# EAGLE design mps340g + mbi270 (EAGLE 9.5.1)
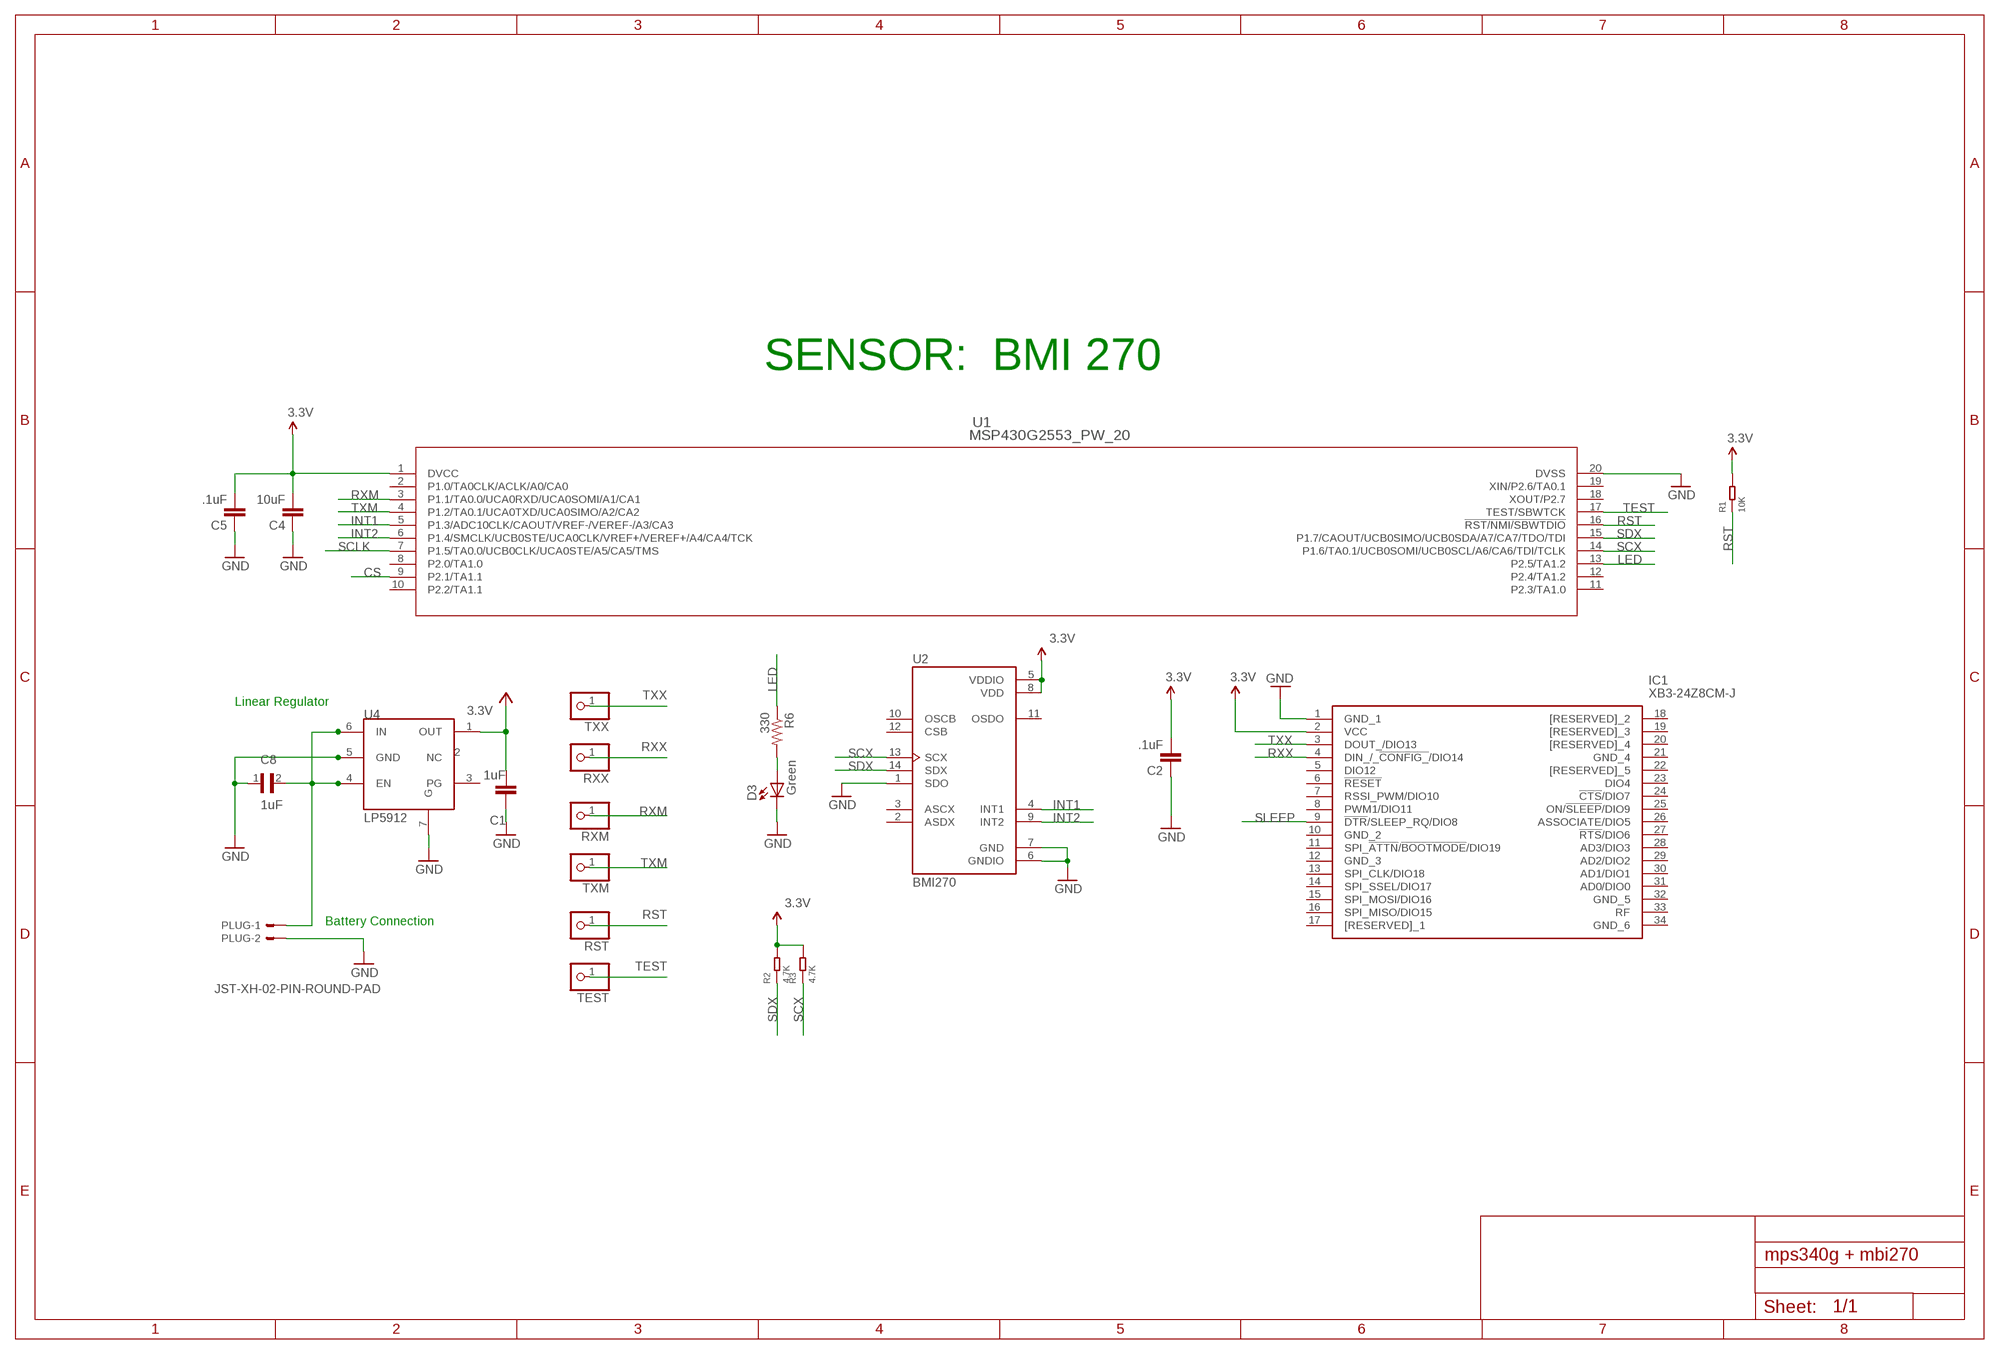
[diagram p0: schematic, sheet 1]

## Parts
C1  1uF  C-EUC0603  [C0603]
C2  .1uF  0.1UF-25V(+80/-20%)(0603)  [0603-CAP]
C4  10uF  0.1UF-25V(+80/-20%)(0603)  [0603-CAP]
C5  .1uF  0.1UF-25V(+80/-20%)(0603)  [0603-CAP]
C8  1uF  0402YD105MAT2A  [CAPC1005X71N]
D3  Green  LED  [0603-LED-ALT1]
IC1  XB3-24Z8CM-J  [XB324Z8CMJ]
PLUG  JST-XH-02-PIN-ROUND-PAD  [JST-XH-02-PACKAGE-ROUND-PAD]
R1  10K  SMD-RES-4.7K-5%-1/16W(0402)  [R0402]
R2  4.7K  SMD-RES-4.7K-5%-1/16W(0402)  [R0402]
R3  4.7K  SMD-RES-4.7K-5%-1/16W(0402)  [R0402]
R6  330  RESISTOR0603-RES  [0603-RES]
RST  PINHD-1X1  [1X01]
RXM  PINHD-1X1  [1X01]
RXX  PINHD-1X1  [1X01]
TEST  PINHD-1X1  [1X01]
TXM  PINHD-1X1  [1X01]
TXX  PINHD-1X1  [1X01]
U1  MSP430G2553_PW_20  [PW20]
U2  BMI270  [XDCR_BMI270]
U4  LP5912  [LP5912]

## Nets
3.3V: C2.2 C4.2 C5.2 IC1.2(VCC) R1.2 R2.2 R3.2 U1.1(DVCC) U2.5(VDDIO) U2.8(VDD)
BATTERY: C8.2 PLUG.1 U4.4(EN) U4.6(IN)
CS: U1.9(P2.1/TA1.1)
GND [vcc]: C1.1 C2.1 C4.1 C5.1 C8.1 D3.C IC1.1(GND_1) PLUG.2 U1.20(DVSS) U2.1(SDO) U2.6(GNDIO) U2.7(GND) U4.5(GND) U4.7(G)
INT1: U1.5(P1.3/ADC10CLK/CAOUT/VREF-/VEREF-/A3/CA3) U2.4(INT1)
INT2: U1.6(P1.4/SMCLK/UCB0STE/UCA0CLK/VREF+/VEREF+/A4/CA4/TCK) U2.9(INT2)
LED: R6.1 U1.13(P2.5/TA1.2)
N$7: D3.A R6.2
RST: R1.1 RST.1 U1.16(!RST/NMI/SBWTDIO)
RXM: RXM.1 U1.3(P1.1/TA0.0/UCA0RXD/UCA0SOMI/A1/CA1)
RXX: IC1.4(DIN_/_!CONFIG_!/DIO14) RXX.1
SCLK: U1.7(P1.5/TA0.0/UCB0CLK/UCA0STE/A5/CA5/TMS)
SCX: R3.1 U1.14(P1.6/TA0.1/UCB0SOMI/UCB0SCL/A6/CA6/TDI/TCLK) U2.13(SCX)
SDX: R2.1 U1.15(P1.7/CAOUT/UCB0SIMO/UCB0SDA/A7/CA7/TDO/TDI) U2.14(SDX)
SLEEP: IC1.9(!DTR!/SLEEP_RQ/DIO8)
TEST: TEST.1 U1.17(TEST/SBWTCK)
TXM: TXM.1 U1.4(P1.2/TA0.1/UCA0TXD/UCA0SIMO/A2/CA2)
TXX: IC1.3(DOUT_/DIO13) TXX.1
VCC: C1.2 U4.1(OUT) ; supply symbol labelled 3.3V
Unconnected: IC1.5(DIO12) IC1.6(!RESET) IC1.7(RSSI_PWM/DIO10) IC1.8(PWM1/DIO11) IC1.10(GND_2) IC1.11(SPI_!ATTN!/!BOOTMODE!/DIO19) IC1.12(GND_3) IC1.13(SPI_CLK/DIO18) IC1.14(SPI_SSEL/DIO17) IC1.15(SPI_MOSI/DIO16) IC1.16(SPI_MISO/DIO15) IC1.17([RESERVED]_1) IC1.18([RESERVED]_2) IC1.19([RESERVED]_3) IC1.20([RESERVED]_4) IC1.21(GND_4) IC1.22([RESERVED]_5) IC1.23(DIO4) IC1.24(!CTS!/DIO7) IC1.25(ON/!SLEEP!/DIO9) IC1.26(ASSOCIATE/DIO5) IC1.27(!RTS!/DIO6) IC1.28(AD3/DIO3) IC1.29(AD2/DIO2) IC1.30(AD1/DIO1) IC1.31(AD0/DIO0) IC1.32(GND_5) IC1.33(RF) IC1.34(GND_6) U1.2(P1.0/TA0CLK/ACLK/A0/CA0) U1.8(P2.0/TA1.0) U1.10(P2.2/TA1.1) U1.11(P2.3/TA1.0) U1.12(P2.4/TA1.2) U1.18(XOUT/P2.7) U1.19(XIN/P2.6/TA0.1) U2.2(ASDX) U2.3(ASCX) U2.10(OSCB) U2.11(OSDO) U2.12(CSB) U4.2(NC) U4.3(PG)

## Notes on the sheet
- SENSOR:  BMI 270
- Linear Regulator
- Battery Connection

## Library data of the parts
C1 = rcl:C-EU: CAPACITOR, European symbol; SPICEPREFIX: C
C2 C4 C5 = SparkFun-Capacitors:0.1UF-25V(+80/-20%)(0603): CAP-00810 Ceramic Standard decoupling cap; PROD_ID: CAP-00810; VALUE: 0.1uF
C8 = Capacitor1uF:0402YD105MAT2A: CAP 1UF 16VDC X5R 20% SMD 0402; AVAILABILITY: Unavailable; DESCRIPTION: Cap 1uf 16vdc X5r 20% Smd 0402; MF: AVX; MP: 0402YD105MAT2A; PACKAGE: 1005 AVX; PRICE: None
D3 = Testing:LED: LEDs Standard schematic elements and footprints for 5mm, 3mm, 1206, and 0603 sized LEDs. 5mm - Spark Fun Electronics SKU : COM-00529 (and others)
IC1 = XB3-24Z8CM-J:XB3-24Z8CM-J: Zigbee Modules (802.15.4) XBee3 ,2.4 Ghz ZB 3.0, Chip Ant, MMT Source: Datasheet <https://www.digi.com/resources/documentation/digidocs/pdfs/90001543.pdf>; DESCRIPTION: Zigbee Modules (802.15.4) XBee3 ,2.4 Ghz ZB 3.0, Chip Ant, MMT; HEIGHT: 4mm; MANUFACTURER_NAME: Digi International; MANUFACTURER_PART_NUMBER: XB3-24Z8CM-J; MOUSER_PART_NUMBER: 888-XB3-24Z8CM-J; MOUSER_PRICE-STOCK: https://www.mouser.com/Search/Refine.aspx?Keyword=888-XB3-24Z8CM-J
PLUG = Rembrandt Electronics - JST XH Connectors v1-0:JST-XH-02-PIN: JST XH Connector 2 Pin Wire to board connector. Pitch: 2,54 mm, (0.100") Number of pins: 2 Created by Rembrandt Electronics www.rembrandtelectronics.com
R1-R3 = RES-4.7K-SMD-5_-1_16W_0402_:SMD-RES-4.7K-5%-1/16W(0402): 301010010; AVAILABILITY: Unavailable; DESCRIPTION: Res Thick Film 0402 4.7K Ohm 5% 0.063W_1/16W_ ?100ppm/C Molded SMD Paper T/R; MF: Yageo; MP: RC0402JR074K7L; PACKAGE: 0402 Yageo; PRICE: None
R6 = SparkFun:RESISTOR: Resistor Basic schematic elements and footprints for 0603, 1206, and PTH resistors.
RST RXM RXX TEST TXM TXX = pinhead:PINHD-1X1: PIN HEADER
U1 = MSP430G2553_PW_20:MSP430G2553_PW_20; BUILT_BY: EMA_UL_Team; MANUFACTURER: Texas Instruments; MANUFACTURER_PART_NUMBER: MSP430G2553_PW_20; VENDOR: Texas Instruments
U2 = BMI270:BMI270: IMU ACCEL/GYRO I2C/SPI 14LGA; AVAILABILITY: Unavailable; DESCRIPTION: Accelerometer, Gyroscope, 6 Axis Sensor I²C, SPI Output; MF: Bosch Sensortec; MP: BMI270; PACKAGE: LGA-14 Bosch Sensortec; PRICE: None
U4 = electronic-labs:LP5912

## Net classes
0 default: width 0.203 mm
1 vcc: width 0.254 mm

## Board
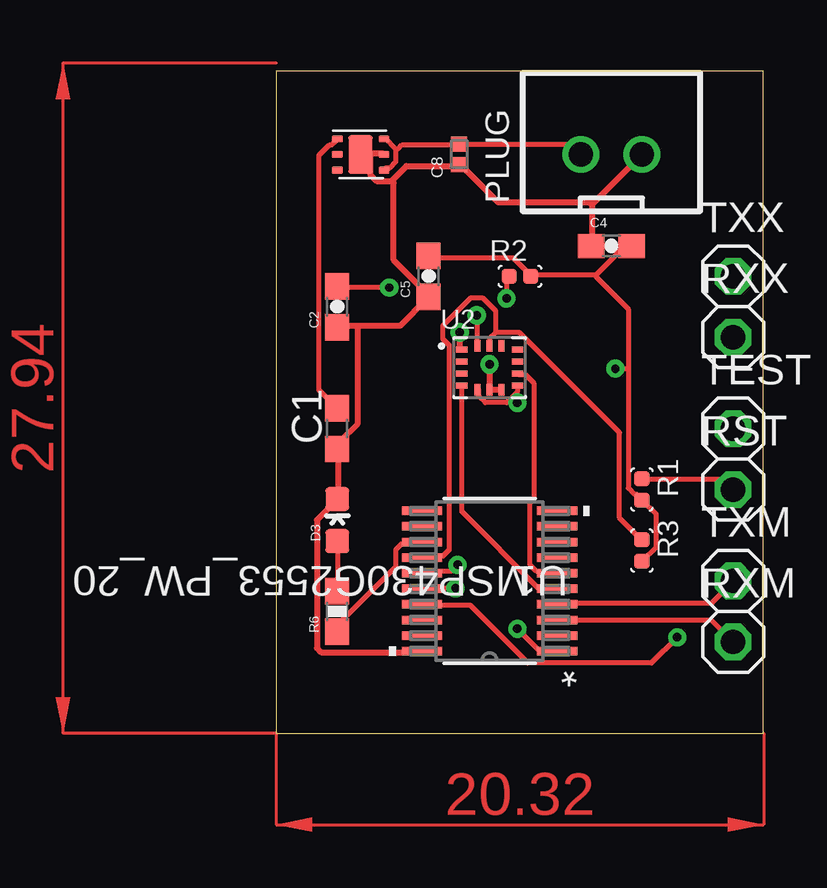
[diagram p1: board, top side]
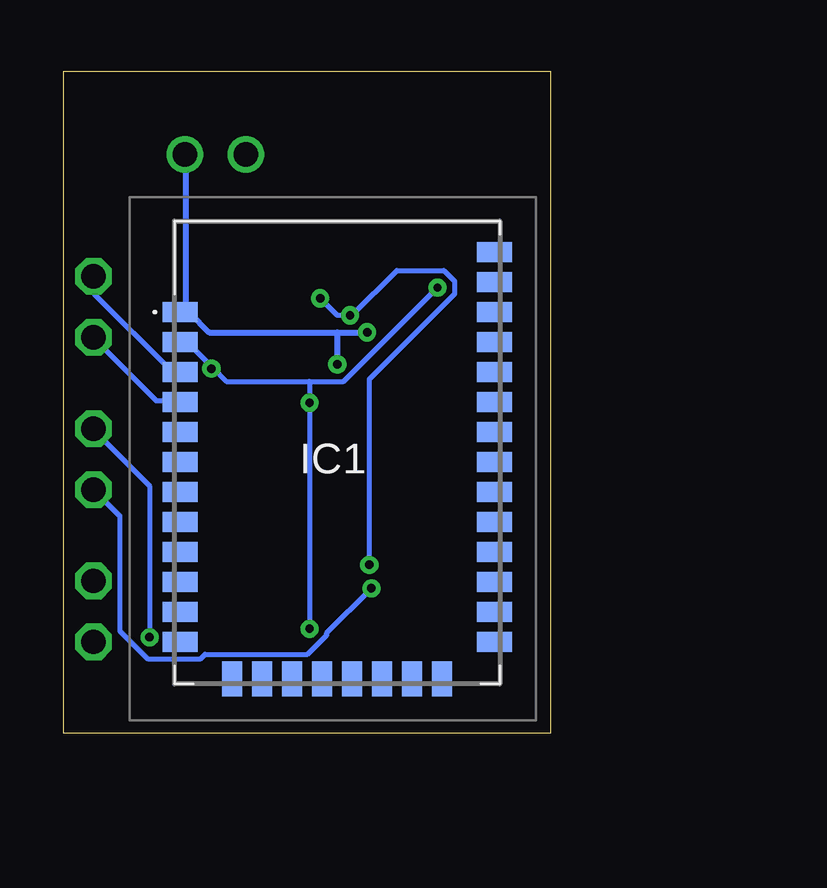
[diagram p2: board, bottom side, seen from below]

Size 20.3 x 27.61 mm. Coordinates in mm from the lower left corner, seen from the top.
Outline: 0,0 20.3,0 20.3,27.61 0,27.61 0,0
Copper layers (1*16): Top 0.035mm / dielectric 1.5mm / Bottom 0.035mm
Design rules "default": minimum track width 6mil, minimum drill 0.35mm, track to track 6mil, track to pad 6mil, pad to pad 6mil, via to via 6mil, smd to smd 6mil, copper to edge 40mil, drill to drill 6mil, minimum pad ring 10mil, minimum via ring 8mil, stop-mask expansion 4mil, vias tented up to drill 0mil, thermal gap 10mil

### Footprints (pad centres in the part's own frame; a part is rotated, then mirrored left to right if it is on the bottom)
C0603 = smd 1.1 x 1: 1 -0.85,0; 2 0.85,0
0603-CAP = smd 1.1 x 1: 1 -0.85,0; 2 0.85,0
CAPC1005X71N = smd 0.62 x 0.67: 1 -0.425,0; 2 0.425,0
0603-LED-ALT1 = smd 1 x 1: A 0,-0.877; C 0,0.877
XB324Z8CMJ = smd 1.448 x 0.838: 1 -6.553,13.75; 2 -6.553,12.5; 3 -6.553,11.25; 4 -6.553,10; 5 -6.553,8.75; 6 -6.553,7.5; 7 -6.553,6.25; 8 -6.553,5; 9 -6.553,3.75; 10 -6.553,2.5; 11 -6.553,1.25; 12 -6.553,0; 21 6.553,0; 22 6.553,1.25; 23 6.553,2.5; 24 6.553,3.75; 25 6.553,5; 26 6.553,6.25; 27 6.553,7.5; 28 6.553,8.75; 29 6.553,10; 30 6.553,11.25; 31 6.553,12.5; 32 6.553,13.75; 33 6.553,15; 34 6.553,16.25 | smd 0.838 x 1.448: 13 -4.375,-1.537; 14 -3.125,-1.537; 15 -1.875,-1.537; 16 -0.625,-1.537; 17 0.625,-1.537; 18 1.875,-1.537; 19 3.125,-1.537; 20 4.375,-1.537
JST-XH-02-PACKAGE-ROUND-PAD = drill 1.016: 1 -1.27,0; 2 1.27,0
R0402 = smd 0.635 x 0.635: 1 0,0.445; 2 0,-0.445
0603-RES = smd 1.1 x 1: 1 -0.85,0; 2 0.85,0
1X01 = drill 1.016 octagon: 1 0,0
PW20 = smd 1.676 x 0.356: 1 -2.819,2.925; 2 -2.819,2.275; 3 -2.819,1.625; 4 -2.819,0.975; 5 -2.819,0.325; 6 -2.819,-0.325; 7 -2.819,-0.975; 8 -2.819,-1.625; 9 -2.819,-2.275; 10 -2.819,-2.925; 11 2.819,-2.925; 12 2.819,-2.275; 13 2.819,-1.625; 14 2.819,-0.975; 15 2.819,-0.325; 16 2.819,0.325; 17 2.819,0.975; 18 2.819,1.625; 19 2.819,2.275; 20 2.819,2.925
XDCR_BMI270 = smd 0.475 x 0.25: 1 -1.163,0.75; 2 -1.163,0.25; 3 -1.163,-0.25; 4 -1.163,-0.75; 8 1.163,-0.75; 9 1.163,-0.25; 10 1.163,0.25; 11 1.163,0.75 | smd 0.25 x 0.475: 5 -0.5,-0.912; 6 0,-0.912; 7 0.5,-0.912; 12 0.5,0.912; 13 0,0.912; 14 -0.5,0.912
LP5912 = smd 0.45 x 0.3: 1 0,0.65; 2 0,0; 3 0,-0.65; 4 1.95,-0.65; 5 1.95,0; 6 1.95,0.65 | smd 1 x 1.6: 7 0.975,0

### Placement (x,y rotation side)
C1  2.54,12.7 90 top
C2  2.54,17.78 90 top
C4  13.97,20.32 0 top
C5  6.35,19.05 90 top
C8  7.62,24.13 90 top
D3  2.54,8.89 0 top
IC1  8.89,3.81 0 bottom
PLUG  13.97,24.13 0 top
R1  15.24,10.16 0 top
R2  10.16,19.05 90 top
R3  15.24,7.62 0 top
R6  2.54,5.08 90 top
RST  19.05,10.16 0 top
RXM  19.05,3.81 0 top
RXX  19.05,16.51 0 top
TEST  19.05,12.7 0 top
TXM  19.05,6.35 0 top
TXX  19.05,19.05 0 top
U1  8.89,6.35 180 top
U2  8.89,15.24 0 top
U4  2.54,24.13 0 top

### Tracks (layer width: path | path; a pad name or v marks a point on that pad's centre or on a via)
3.3V  (via drill 0.35)
  Top 0.203: R3.2 15.29,7.2 15.82,7.73 15.82,9.16 15.29,9.69 R1.2 15.2,9.78 15.02,9.96 14.94,9.96 14.67,10.22 14.67,15.2 | C5.2 6.4,19.82 9.87,19.82 10.58,19.11 R2.2 10.67,19.11 13.34,19.11 | 13.34,19.11 14.49,20.27 14.76,20.27 C4.2 | 14.67,15.2 14.67,17.69 13.34,19.02 13.34,19.11 | 9.82,14 10.05,14.22 10.05,14.4 U2.8 | 9.82,14 9.6,13.78 8.71,13.78 8.45,14.05 8.45,14.31 U2.5 | v4.71,18.58 2.58,18.58 C2.2 | v10.05,13.78 9.82,14 | v10.05,4.36 10.94,3.47 11.65,3.47 U1.1 | v14.13,15.2 14.67,15.2
  Bottom 0.203: v4.71,18.58 8.62,14.67 10.05,14.67 | 10.05,14.67 13.51,14.67 14.09,15.25 | 14.09,15.25 15.11,16.27 15.38,16.27 IC1.2 | 10.05,14.67 v10.05,13.78 v10.05,4.36 | v14.13,15.2 14.09,15.25
BATTERY
  Top 0.203: 4.98,24.36 4.98,23.82 4.71,23.56 4.53,23.56 U4.4 | 4.98,24.36 4.53,24.8 U4.6 | 4.98,24.36 5.07,24.36 5.25,24.54 7.56,24.54 C8.2 7.64,24.54 12.27,24.54 12.62,24.18 PLUG.1
GND  (via drill 0.35)
  Top 0.254: U1.20 6.04,3.38 1.87,3.38 1.69,3.56 1.69,8.89 2.49,9.69 D3.C 2.58,9.78 2.58,11.82 C1.1 2.67,11.91 2.67,12.18 3.38,12.89 3.38,16.98 | U2.7 9.34,14.31 8.89,14.31 U2.6 v8.89,15.38 | v7.64,16.71 7.64,16 U2.1 | 13.16,22.05 13.16,20.36 C4.1 | PLUG.2 13.16,22.05 | U4.5 4.45,24.18 3.56,24.18 U4.7 3.91,24.09 3.91,23.29 4.18,23.02 4.8,23.02 | 4.8,23.02 5.42,23.65 7.56,23.65 C8.1 7.73,23.65 9.25,22.14 13.07,22.14 13.16,22.05 | 3.38,16.98 5.16,16.98 6.31,18.14 C5.1 6.31,18.31 4.89,19.74 4.89,22.94 4.8,23.02 | 3.38,16.98 2.58,16.98 C2.1
  Bottom 0.254: 8.89,16.71 14.22,16.71 15.02,17.51 15.38,17.51 IC1.1 15.2,17.6 15.2,24.09 PLUG.2 | 8.89,16.71 v7.64,16.71 | 8.89,16.71 v8.89,15.38
INT1
  Top 0.203: U2.4 7.73,14.4 7.73,9.25 10.94,6.04 11.65,6.04 U1.5
INT2
  Top 0.203: U2.9 10.13,14.94 10.4,14.94 10.76,14.58 10.76,9.78 10.58,9.6 10.58,7.02 10.85,6.76 11.65,6.76 U1.6
LED
  Top 0.203: R6.1 2.58,4.27 2.58,4.53 4.98,6.93 4.98,7.64 5.25,7.91 6.04,7.91 U1.13
N$7
  Top 0.203: D3.A 2.58,8 2.58,5.96 R6.2
RST  (via drill 0.35)
  Top 0.203: R1.1 15.29,10.58 18.67,10.58 19.02,10.22 RST.1 | v7.47,6.04 6.13,6.04 U1.16
  Bottom 0.203: v7.47,6.04 9.34,4.18 9.34,4.09 10.13,3.29 14.4,3.29 14.58,3.11 16.8,3.11 17.96,4.27 17.96,9.07 RST.1
RXM
  Top 0.203: U1.3 11.73,4.71 18.14,4.71 19.02,3.82 RXM.1
RXX
  Bottom 0.203: IC1.4 15.47,13.87 16.45,13.87 19.02,16.45 RXX.1
SCX
  Top 0.203: U2.13 8.89,16.45 9.16,16.71 | 9.16,16.71 10.13,16.71 14.31,12.54 14.31,8.98 15.2,8.09 R3.1 | 9.16,16.71 9.16,17.6 8.62,18.14 8.09,18.14 6.93,16.98 6.93,16.45 7.2,16.18 7.2,7.64 6.93,7.38 6.13,7.38 U1.14
SDX  (via drill 0.35)
  Top 0.203: v8.36,17.42 8.36,16.18 U2.14 | v9.6,18.14 9.6,18.94 R2.1 | v7.56,7.02 7.29,6.76 6.13,6.76 U1.15
  Bottom 0.203: v9.6,18.14 8.89,17.42 v8.36,17.42 8.27,17.42 6.4,19.29 4.45,19.29 4,18.85 4,18.31 7.56,14.76 v7.56,7.02
TEST  (via drill 0.35)
  Top 0.203: v16.71,4 15.65,2.93 10.49,2.93 8.09,5.33 6.13,5.33 U1.17
  Bottom 0.203: v16.71,4 16.71,10.31 19.02,12.62 TEST.1
TXM
  Top 0.203: U1.4 11.73,5.42 18.14,5.42 19.02,6.31 TXM.1
TXX
  Bottom 0.203: IC1.3 15.47,15.11 15.82,15.11 19.02,18.31 19.02,19.02 TXX.1
VCC
  Top 0.203: U4.1 2.49,24.71 2.31,24.54 2.22,24.54 1.78,24.09 1.78,14.31 2.49,13.6 C1.2
(copper drawn outside any net)
  shapes: Top area x2